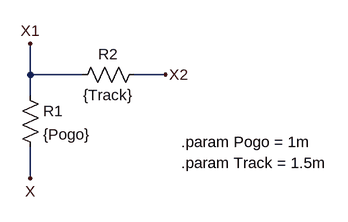
[diagram p0: schematic IVProbingPCB.asc]
IVProbingPCB.asc, the LTspice schematic file:
Version 4
SHEET 1 880 680
WIRE 176 112 176 64
WIRE 256 112 176 112
WIRE 384 112 336 112
WIRE 176 144 176 112
WIRE 176 272 176 224
FLAG 176 272 X
FLAG 384 112 X2
FLAG 176 64 X1
SYMBOL res 160 128 R0
SYMATTR InstName R1
SYMATTR Value {Pogo}
SYMBOL res 352 96 R90
WINDOW 0 0 56 VBottom 2
WINDOW 3 32 56 VTop 2
SYMATTR InstName R2
SYMATTR Value {Track}
TEXT 408 216 Left 2 !.param Pogo = 1m
TEXT 408 248 Left 2 !.param Track = 1.5m

The netlist it stands for:
* IVProbingPCB.asc
R1 X1 X {Pogo}
R2 X2 X1 {Track}
.param Pogo = 1m
.param Track = 1.5m
.backanno
.end